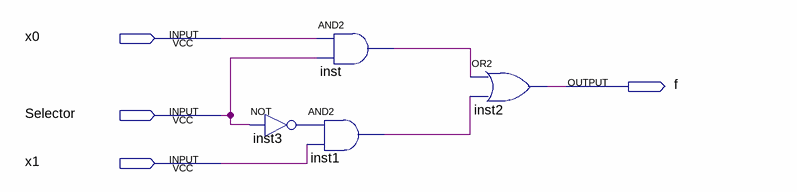
[diagram p0: schematic sheet]
// Quartus schematic Multiplexer.bdf as structural Verilog: 4 symbols, 4 pins
module Multiplexer (
  input  x0,
  input  Selector,
  input  x1,
  output f
);

  wire inst1_out, inst3_out, inst_out;

  and inst (inst_out, x0, Selector);
  and inst1 (inst1_out, inst3_out, x1);
  not inst3 (inst3_out, Selector);
  or inst2 (f, inst_out, inst1_out);
endmodule
